# EAGLE schematic Old Shutters Signal Interface (EAGLE 9.0.0)
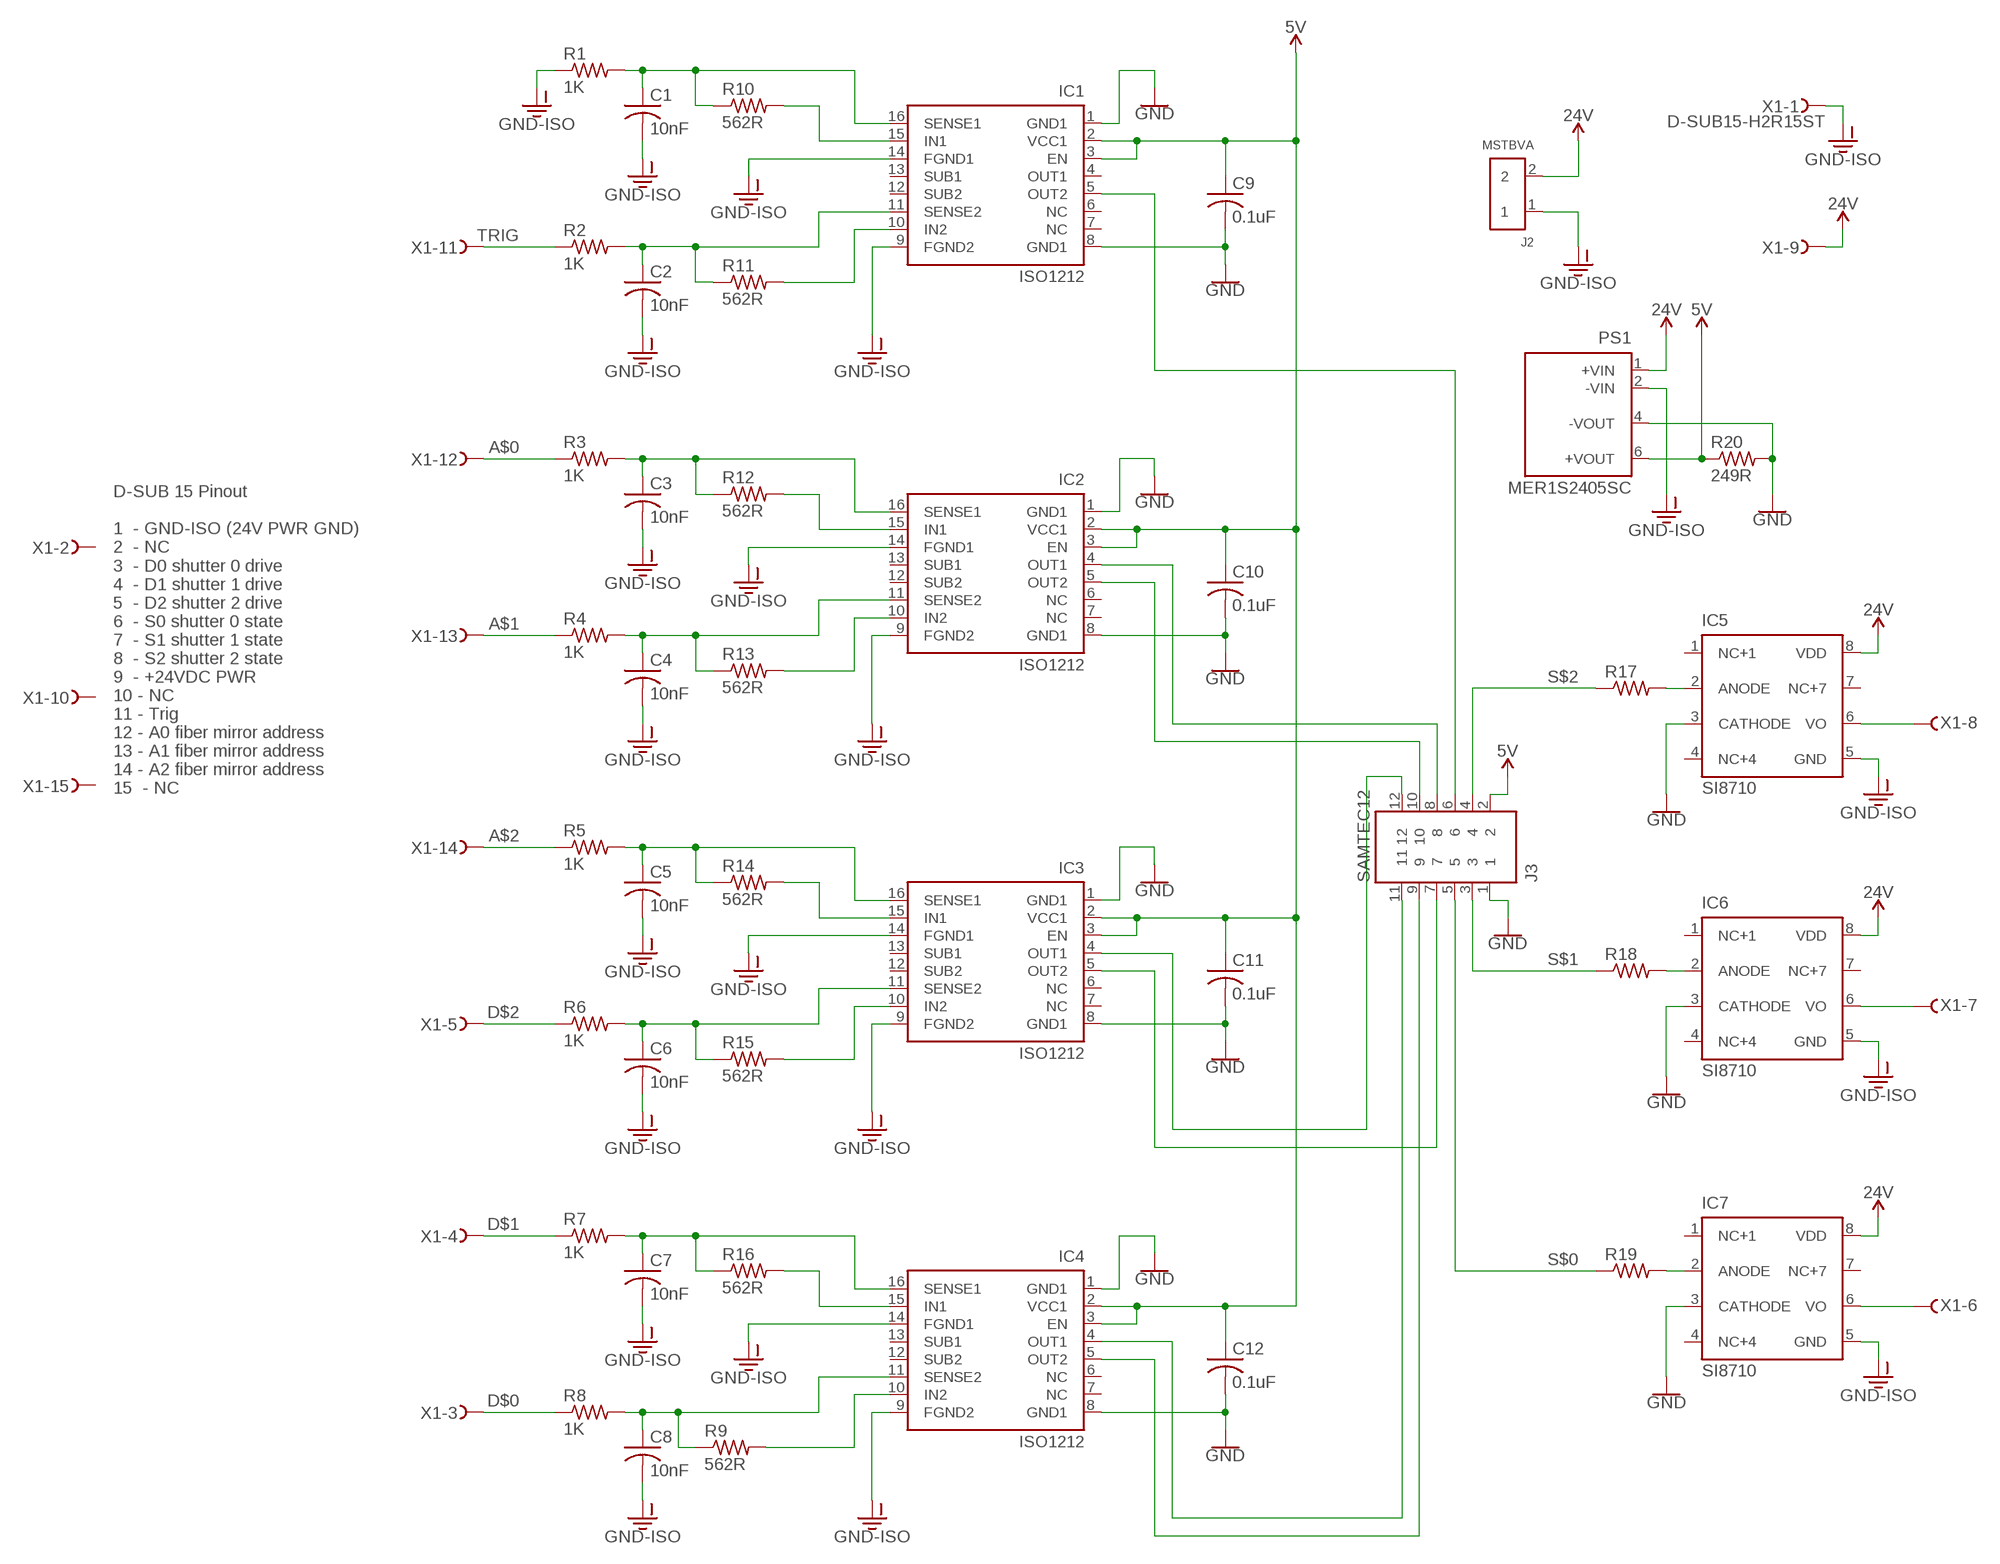
[diagram p0: schematic, sheet 1]

## Parts
C1  10nF  C-USC0805  [C0805]
C2  10nF  C-USC0805  [C0805]
C3  10nF  C-USC0805  [C0805]
C4  10nF  C-USC0805  [C0805]
C5  10nF  C-USC0805  [C0805]
C6  10nF  C-USC0805  [C0805]
C7  10nF  C-USC0805  [C0805]
C8  10nF  C-USC0805  [C0805]
C9  0.1uF  C-USC0805  [C0805]
C10  0.1uF  C-USC0805  [C0805]
C11  0.1uF  C-USC0805  [C0805]
C12  0.1uF  C-USC0805  [C0805]
IC1  ISO1212  [ISO1212]
IC2  ISO1212  [ISO1212]
IC3  ISO1212  [ISO1212]
IC4  ISO1212  [ISO1212]
IC5  SI8710  [SO08]
IC6  SI8710  [SO08]
IC7  SI8710  [SO08]
J2  MSTBVA  [MSTBVA]
J3  SAMTEC12  [SAMTEC12]
PS1  MER1S2405SC  MER1  [MER1]
R1  1K  R-US_R0805  [R0805]
R2  1K  R-US_R0805  [R0805]
R3  1K  R-US_R0805  [R0805]
R4  1K  R-US_R0805  [R0805]
R5  1K  R-US_R0805  [R0805]
R6  1K  R-US_R0805  [R0805]
R7  1K  R-US_R0805  [R0805]
R8  1K  R-US_R0805  [R0805]
R9  562R  R-US_R0805  [R0805]
R10  562R  R-US_R0805  [R0805]
R11  562R  R-US_R0805  [R0805]
R12  562R  R-US_R0805  [R0805]
R13  562R  R-US_R0805  [R0805]
R14  562R  R-US_R0805  [R0805]
R15  562R  R-US_R0805  [R0805]
R16  562R  R-US_R0805  [R0805]
R17  R-US_R0805  [R0805]
R18  R-US_R0805  [R0805]
R19  R-US_R0805  [R0805]
R20  249R  R-US_R0805  [R0805]
X1  D-SUB15-H2R15ST  [H2R15ST]

## Nets
5V: C9.1 C10.1 C11.1 C12.1 IC1.2(VCC1) IC1.3(EN) IC2.2(VCC1) IC2.3(EN) IC3.2(VCC1) IC3.3(EN) IC4.2(VCC1) IC4.3(EN) J3.2 PS1.6(+VOUT) R20.1
24V [pwr]: IC5.8(VDD) IC6.8(VDD) IC7.8(VDD) J2.2 PS1.1(+VIN) X1.9
A$0: R3.1 X1.12
A$1: R4.1 X1.13
A$2: R5.1 X1.14
D$0: R8.1 X1.3
D$1: R7.1 X1.4
D$2: R6.1 X1.5
GND: C9.2 C10.2 C11.2 C12.2 IC1.1(GND1) IC1.8(GND1) IC2.1(GND1) IC2.8(GND1) IC3.1(GND1) IC3.8(GND1) IC4.1(GND1) IC4.8(GND1) IC5.3(CATHODE) IC6.3(CATHODE) IC7.3(CATHODE) J3.1 PS1.4(-VOUT) R20.2
GND-ISO [pwr]: C1.2 C2.2 C3.2 C4.2 C5.2 C6.2 C7.2 C8.2 IC1.9(FGND2) IC1.14(FGND1) IC2.9(FGND2) IC2.14(FGND1) IC3.9(FGND2) IC3.14(FGND1) IC4.9(FGND2) IC4.14(FGND1) IC5.5(GND) IC6.5(GND) IC7.5(GND) J2.1 PS1.2(-VIN) R1.1 X1.1
N$1: IC5.2(ANODE) R17.2
N$2: C1.1 IC1.16(SENSE1) R1.2 R10.1
N$3: IC7.6(VO) X1.6
N$4: IC1.15(IN1) R10.2
N$5: IC1.10(IN2) R11.2
N$6: C2.1 IC1.11(SENSE2) R2.2 R11.1
N$7: IC2.15(IN1) R12.2
N$8: C3.1 IC2.16(SENSE1) R3.2 R12.1
N$9: C4.1 IC2.11(SENSE2) R4.2 R13.1
N$10: C5.1 IC3.16(SENSE1) R5.2 R14.1
N$11: C6.1 IC3.11(SENSE2) R6.2 R15.1
N$12: C7.1 IC4.16(SENSE1) R7.2 R16.1
N$13: C8.1 IC4.11(SENSE2) R8.2 R9.1
N$14: IC2.10(IN2) R13.2
N$15: IC3.15(IN1) R14.2
N$16: IC3.10(IN2) R15.2
N$17: IC4.15(IN1) R16.2
N$18: IC4.10(IN2) R9.2
N$19: IC6.6(VO) X1.7
N$20: IC5.6(VO) X1.8
N$28: IC1.5(OUT2) J3.6
N$29: IC2.4(OUT1) J3.8
N$30: IC2.5(OUT2) J3.10
N$31: IC3.4(OUT1) J3.12
N$32: IC3.5(OUT2) J3.7
N$34: IC6.2(ANODE) R18.2
N$36: IC7.2(ANODE) R19.2
N$37: IC4.5(OUT2) J3.9
N$38: IC4.4(OUT1) J3.11
S$0: J3.5 R19.1
S$1: J3.3 R18.1
S$2: J3.4 R17.1
TRIG: R2.1 X1.11
Unconnected: IC1.4(OUT1) IC1.6(NC) IC1.7(NC) IC1.12(SUB2) IC1.13(SUB1) IC2.6(NC) IC2.7(NC) IC2.12(SUB2) IC2.13(SUB1) IC3.6(NC) IC3.7(NC) IC3.12(SUB2) IC3.13(SUB1) IC4.6(NC) IC4.7(NC) IC4.12(SUB2) IC4.13(SUB1) IC5.1(NC+1) IC5.4(NC+4) IC5.7(NC+7) IC6.1(NC+1) IC6.4(NC+4) IC6.7(NC+7) IC7.1(NC+1) IC7.4(NC+4) IC7.7(NC+7) X1.2 X1.10 X1.15

## Notes on the sheet
- D-SUB 15 Pinout
  
  1  - GND-ISO (24V PWR GND)
  2  - NC
  3  - D0 shutter 0 drive
  4  - D1 shutter 1 drive
  5  - D2 shutter 2 drive
  6  - S0 shutter 0 state
  7  - S1 shutter 1 state
  8  - S2 shutter 2 state 
  9  - +24VDC PWR
  10 - NC
  11 - Trig
  12 - A0 fiber mirror address
  13 - A1 fiber mirror address
  14 - A2 fiber mirror address
  15  - NC

## Library data of the parts
C1-C12 = rcl:C-US: CAPACITOR, American symbol; SPICEPREFIX: C
IC1-IC4 = AU:ISO1212
IC5-IC7 = AU:SI8710: Si8710 Opto-coupler emulator
J2 = AU:MSTBVA: Phoenix Contact MSTBVA Vertical Terminal Block Phoenix order number 1755736 Digikey: 277-1150-ND Mating part is Phoneix Contact Combicon Spring Cage plug TFCK 5.08 mm pitch Digikey: 277-6941-ND
J3 = AU:SAMTEC12
PS1 = AU:MER1
R1-R20 = rcl:R-US_: RESISTOR, American symbol; SPICEPREFIX: R
X1 = con-thomas-betts:D-SUB15-: D-Subminiatur Connector Source: Electronioc Interconnects European Edition 1998; OC_FARNELL: unknown; OC_NEWARK: unknown

## Net classes
1 pwr: width 0.254 mm, clearance 0.254 mm